# EAGLE design MODULO2_pp (EAGLE 7.1.0)
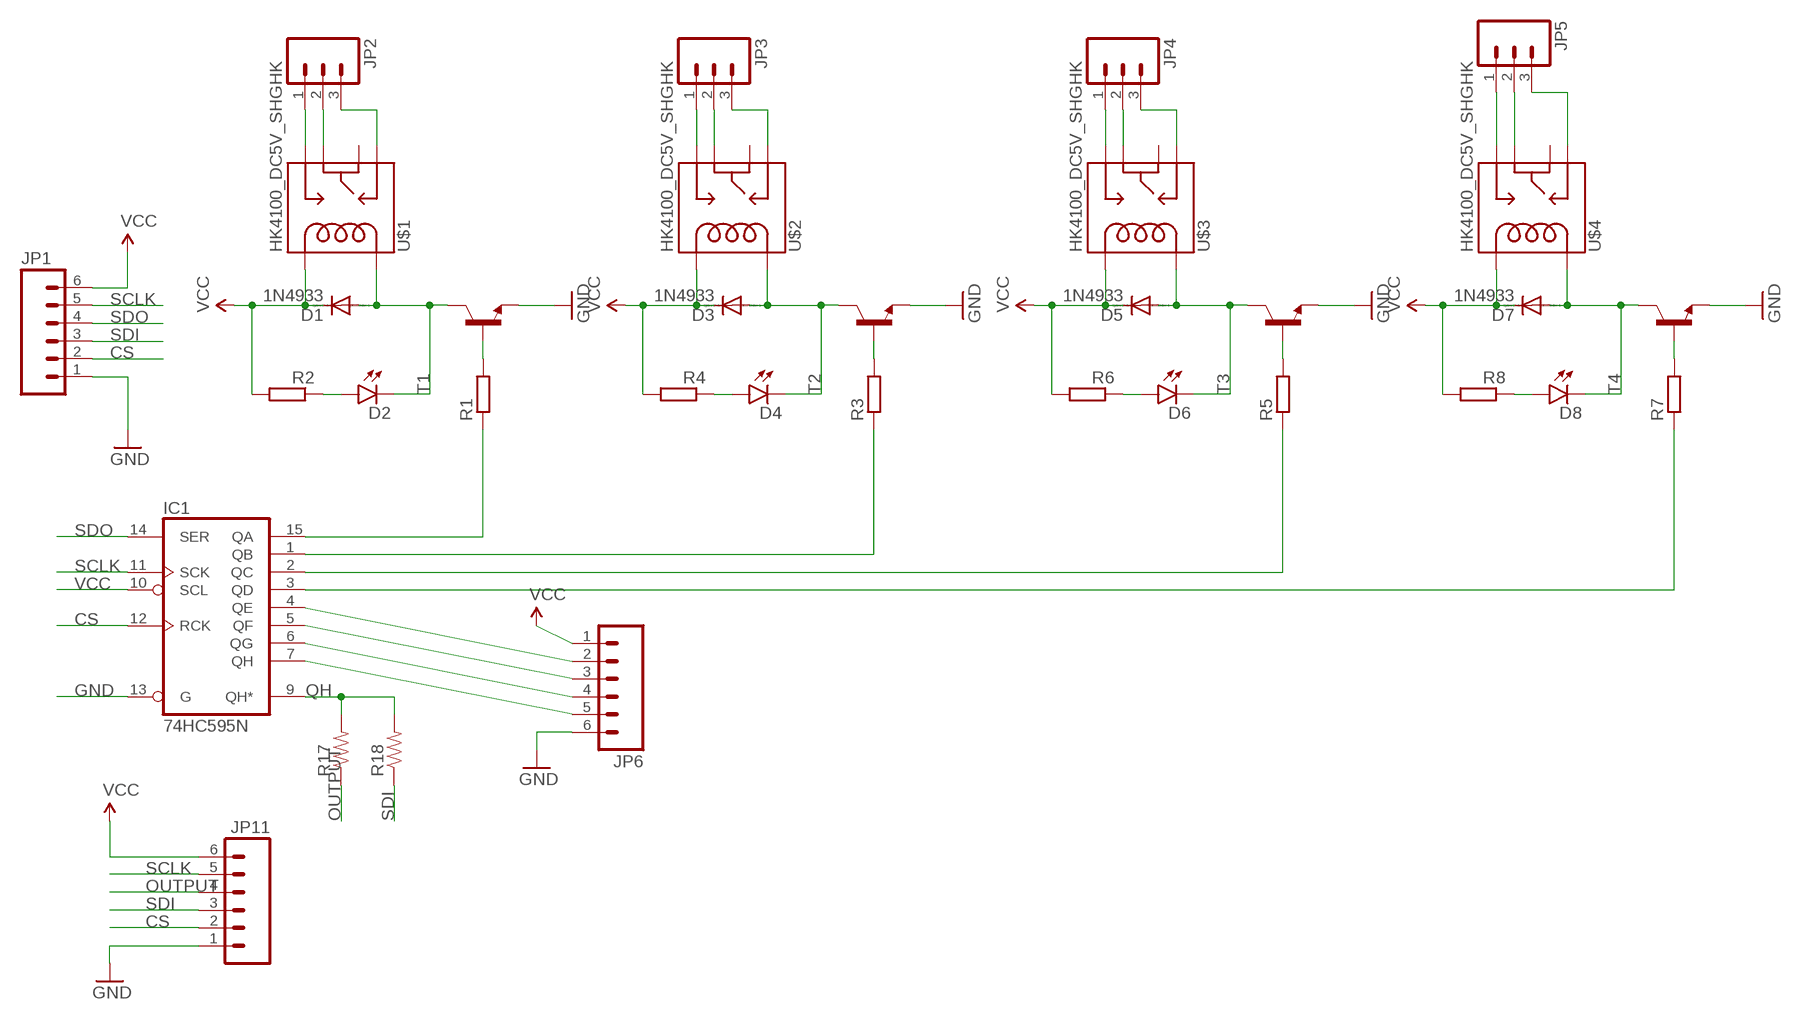
[diagram p0: schematic, sheet 1]

## Parts
D1  1N4933  [DO41-10]
D2  LED5MM  [LED5MM]
D3  1N4933  [DO41-10]
D4  LED5MM  [LED5MM]
D5  1N4933  [DO41-10]
D6  LED5MM  [LED5MM]
D7  1N4933  [DO41-10]
D8  LED5MM  [LED5MM]
IC1  74HC595N  [DIL16]
JP1  M06SILK_FEMALE_PTH  [1X06]
JP2  M03-SCREW-5MM  [SCREWTERMINAL-5MM-3]
JP3  M03-SCREW-5MM  [SCREWTERMINAL-5MM-3]
JP4  M03-SCREW-5MM  [SCREWTERMINAL-5MM-3]
JP5  M03-SCREW-5MM  [SCREWTERMINAL-5MM-3]
JP6  M06SILK_FEMALE_PTH  [1X06]
JP11  M06SILK_FEMALE_PTH  [1X06]
R1  R-EU_R0805  [R0805]
R2  R-EU_R0805  [R0805]
R3  R-EU_R0805  [R0805]
R4  R-EU_R0805  [R0805]
R5  R-EU_R0805  [R0805]
R6  R-EU_R0805  [R0805]
R7  R-EU_R0805  [R0805]
R8  R-EU_R0805  [R0805]
R17  RESISTOR0805-RES  [0805]
R18  RESISTOR0805-RES  [0805]
T1  -NPN-TO92-EBC  [TO92-EBC]
T2  -NPN-TO92-EBC  [TO92-EBC]
T3  -NPN-TO92-EBC  [TO92-EBC]
T4  -NPN-TO92-EBC  [TO92-EBC]
U$1  HK4100_DC5V_SHGHK  [HK4100]
U$2  HK4100_DC5V_SHGHK  [HK4100]
U$3  HK4100_DC5V_SHGHK  [HK4100]
U$4  HK4100_DC5V_SHGHK  [HK4100]

## Nets
CS: IC1.12(RCK) JP1.2 JP11.2
GND: IC1.13(G) JP1.1 JP6.6 JP11.1 T1.E T2.E T3.E T4.E
N$1: IC1.15(QA) R1.1
N$2: IC1.1(QB) R3.1
N$3: D1.A D2.K(C) T1.C U$1.6
N$4: D2.A R2.1
N$5: R1.2 T1.B
N$6: D3.A D4.K(C) T2.C U$2.6
N$7: D5.A D6.K(C) T3.C U$3.6
N$8: D6.A R6.1
N$9: R5.2 T3.B
N$10: D7.A D8.K(C) T4.C U$4.6
N$11: D8.A R8.1
N$12: R7.2 T4.B
N$13: IC1.3(QD) R7.1
N$14: D4.A R4.1
N$15: R3.2 T2.B
N$16: IC1.2(QC) R5.1
N$17: IC1.4(QE) JP6.2
N$18: IC1.5(QF) JP6.3
N$19: IC1.6(QG) JP6.4
N$20: IC1.7(QH) JP6.5
N$33: JP2.1 U$1.8
N$34: JP2.2 U$1.14
N$35: JP2.3 U$1.7
N$36: JP3.1 U$2.8
N$37: JP3.2 U$2.14
N$38: JP3.3 U$2.7
N$39: JP4.1 U$3.8
N$40: JP4.2 U$3.14
N$41: JP4.3 U$3.7
N$42: JP5.1 U$4.8
N$43: JP5.2 U$4.14
N$44: JP5.3 U$4.7
OUTPUT: JP11.4 R17.1
QH: IC1.9(QH*) R17.2 R18.2
SCLK: IC1.11(SCK) JP1.5 JP11.5
SDI: JP1.3 JP11.3 R18.1
SDO: IC1.14(SER) JP1.4
VCC: D1.C D3.C D5.C D7.C IC1.10(SCL) JP1.6 JP6.1 JP11.6 R2.2 R4.2 R6.2 R8.2 U$1.9 U$2.9 U$3.9 U$4.9
Unconnected: U$1.1 U$2.1 U$3.1 U$4.1

## Power pins joined to a net without a drawn wire
GND: IC1.8(GND)
VCC: IC1.16(VCC)

## Library data of the parts
D1 D3 D5 D7 = diode:1N4933: DIODE fast recovery rectifier, 1A
D2 D4 D6 D8 = SparkFun-LED:LED: LEDs Standard schematic elements and footprints for 5mm, 3mm, 1206, and 0603 sized LEDs. 5mm - Spark Fun Electronics SKU : COM-00529 (and others)
IC1 = 74xx-eu:74*595: 8-bit SHIFT REGISTER, output latch
JP1 JP6 JP11 = SparkFun-Connectors:M06: Header 6 Standard 6-pin 0.1" header. Use with straight break away headers (SKU : PRT-00116), right angle break away headers (PRT-00553), swiss pins (PRT-00743), machine pins (PRT-00117), and female headers (PRT-00115). Molex polarized connector foot print use with SKU : PRT-08094 with associated crimp pins and housings. NOTES ON THE VARIANTS LOCK and LOCK_LONGPADS... This footprint was designed to help hold the alignment of a through-hole component (i.e. 6-pin header) while soldering it into place. You may notice that each hole has been shifted either up or down by 0.005 of an inch from it's more standard position (which is a perfectly straight line). This slight alteration caused the pins (the squares in the middle) to touch the edges of the holes. Because they are alternating, it causes a "brace" to hold the component in place. 0.005 has proven to be the perfect amount of "off-center" position when using our standard breakaway headers. Although looks a little odd when you look at the bare footprint, once you have a header in there, the alteration is very hard to notice. Also,if you push a header all the way into place, it is covered up entirely on the bottom side. This idea of altering the position of holes to aid alignment will be further integrated into the Sparkfun Library for other footprints. It can help hold any component with 3 or more connection pins.; PROD_ID: CONN-08437
JP2-JP5 = SparkFun-Connectors:M03: Header 3 Standard 3-pin 0.1" header. Use with straight break away headers (SKU : PRT-00116), right angle break away headers (PRT-00553), swiss pins (PRT-00743), machine pins (PRT-00117), and female headers (PRT-00115). Molex polarized connector foot print use with SKU : PRT-08232 with associated crimp pins and housings.; STOREFRONT_ID: PRT-08433
R1-R8 = resistor:R-EU_: RESISTOR, European symbol
R17 R18 = SparkFun-Resistors:RESISTOR: Resistor Basic schematic elements and footprints for 0603, 1206, and PTH resistors.
T1-T4 = transistor:*-NPN-: NPN Transistror BF959 corrected 2008.03.06
U$1-U$4 = SparkFun-Electromechanical:HK4100_DC5V_SHG

## Board
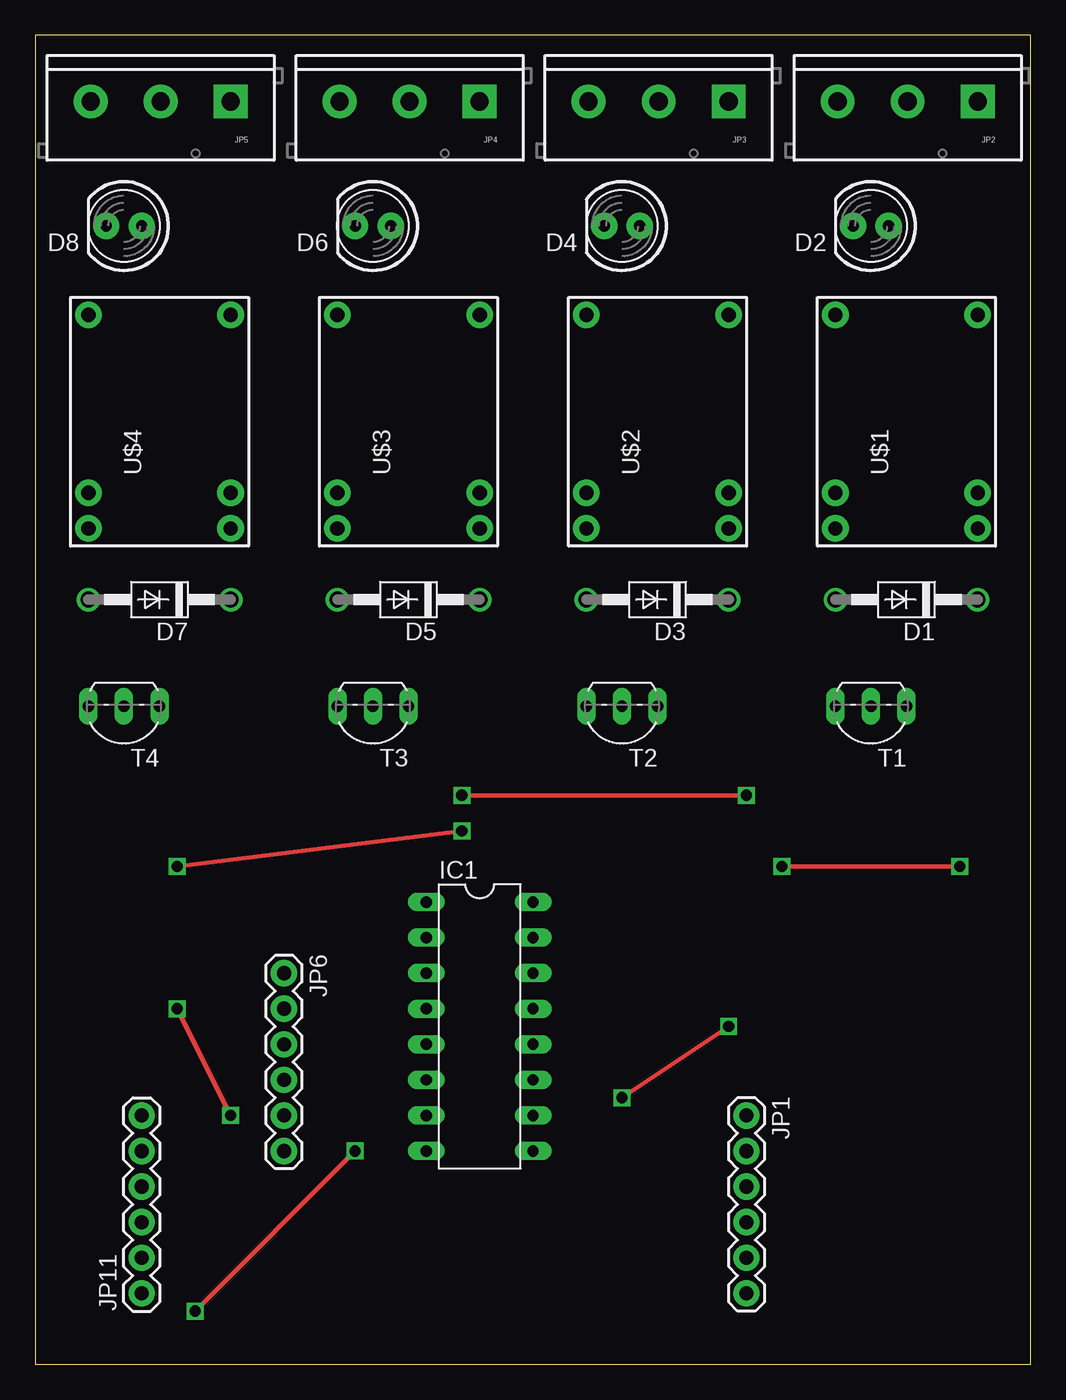
[diagram p1: board, top side]
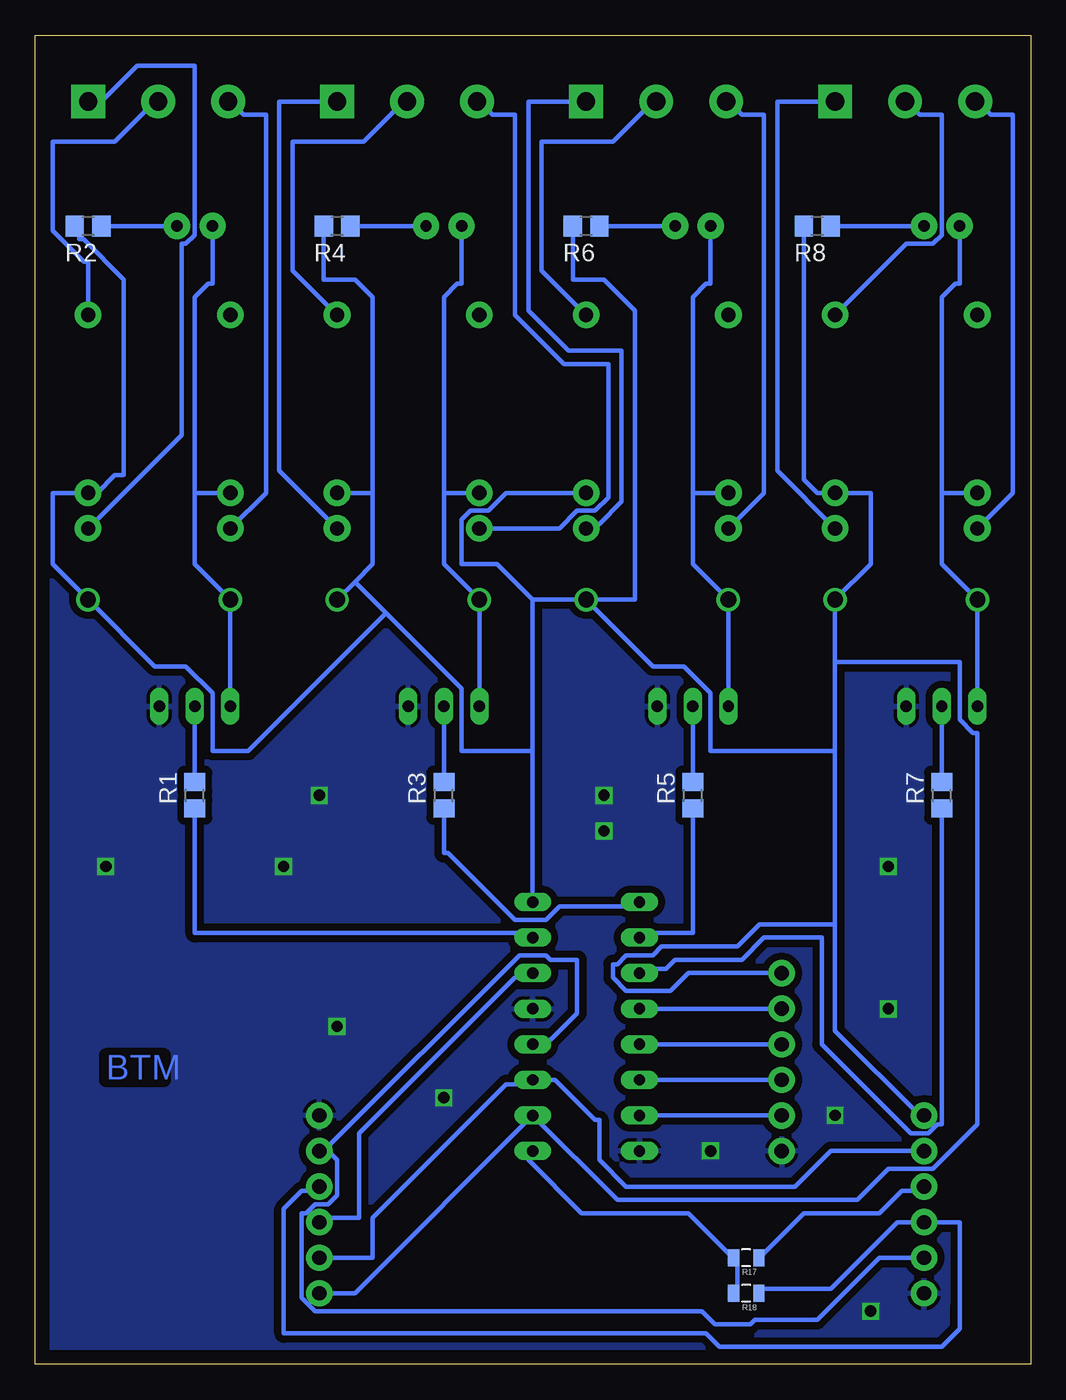
[diagram p2: board, bottom side, seen from below]

Size 71.1 x 94.92 mm. Coordinates in mm from the lower left corner, seen from the top.
Outline: 0,0 71.1,0 71.1,94.92 0,94.92 0,0
Copper layers (1*16): Top 0.035mm / dielectric 1.5mm / Bottom 0.035mm
Design rules "default *": minimum track width 13mil, minimum drill 24mil, track to track 20mil, track to pad 6mil, pad to pad 8mil, via to via 8mil, smd to smd 8mil, copper to edge 40mil, drill to drill 8mil, minimum pad ring 10mil, minimum via ring 8mil, stop-mask expansion 4mil, vias tented up to drill 0mil, thermal gap 10mil

### Footprints (pad centres in the part's own frame; a part is rotated, then mirrored left to right if it is on the bottom)
DO41-10 = drill 1.118: A 5.08,0; C -5.08,0
LED5MM = drill 0.813 pad 1.88: A -1.27,0; K 1.27,0
DIL16 = drill 0.813 long: 1 -8.89,-3.81; 2 -6.35,-3.81; 3 -3.81,-3.81; 4 -1.27,-3.81; 5 1.27,-3.81; 6 3.81,-3.81; 7 6.35,-3.81; 8 8.89,-3.81; 9 8.89,3.81; 10 6.35,3.81; 11 3.81,3.81; 12 1.27,3.81; 13 -1.27,3.81; 14 -3.81,3.81; 15 -6.35,3.81; 16 -8.89,3.81
1X06 = drill 1.016 pad 1.88: 1 0,0; 2 2.54,0; 3 5.08,0; 4 7.62,0; 5 10.16,0; 6 12.7,0
SCREWTERMINAL-5MM-3 = drill 1.3 pad 2.413 square: 1 0,0 | drill 1.3 pad 2.413: 2 5,0; 3 10,0
R0805 = smd 1.3 x 1.5: 1 -0.95,0; 2 0.95,0
0805 = smd 0.8 x 1.2: 1 -0.9,0; 2 0.9,0
TO92-EBC = drill 0.813 long: B 0,-1.27; C 2.54,-1.27; E -2.54,-1.27
HK4100 = drill 1.016 pad 1.905: 1 7.62,5.08; 6 -5.08,5.08; 7 -7.62,5.08; 8 -7.62,-5.08; 9 -5.08,-5.08; 14 7.62,-5.08

### Placement (x,y rotation side)
D1  62.23,54.61 180 top
D2  59.69,81.28 180 top
D3  44.45,54.61 180 top
D4  41.91,81.28 180 top
D5  26.67,54.61 180 top
D6  24.13,81.28 180 top
D7  8.89,54.61 180 top
D8  6.35,81.28 180 top
IC1  31.75,24.13 270 top
JP1  50.8,17.78 270 top
JP2  67.31,90.17 180 top
JP3  49.53,90.17 180 top
JP4  31.75,90.17 180 top
JP5  13.97,90.17 180 top
JP6  17.78,27.94 270 top
JP11  7.62,5.08 90 top
R1  59.69,40.64 90 bottom
R2  67.31,81.28 180 bottom
R3  41.91,40.64 90 bottom
R4  49.53,81.28 180 bottom
R5  24.13,40.64 90 bottom
R6  31.75,81.28 180 bottom
R7  6.35,40.64 90 bottom
R8  15.24,81.28 180 bottom
R17  20.32,7.62 180 bottom
R18  20.32,5.08 180 bottom
T1  59.69,45.72 180 top
T2  41.91,45.72 180 top
T3  24.13,45.72 180 top
T4  6.35,45.72 180 top
U$1  62.23,67.31 90 top
U$2  44.45,67.31 90 top
U$3  26.67,67.31 90 top
U$4  8.89,67.31 90 top

### Tracks (layer width: path | path; a pad name or v marks a point on that pad's centre or on a via)
CS
  Bottom 0.33: IC1.12 35.24,23.18 34.29,23.18 32.38,25.08 32.38,28.89 34.29,28.89 34.61,29.21 36.51,29.21 50.48,15.24 | JP11.2 10.79,7.62 15.24,3.17 19.68,3.17 20,2.86 22.54,2.86 23.5,3.81 51.12,3.81 52.07,4.76 52.07,10.79 51.75,10.79 51.12,11.43 50.16,11.43 49.53,12.06 49.53,14.61 50.16,15.24 50.48,15.24 | 50.48,15.24 JP1.2
GND  (via drill 0.8)
  Top 0.305: v50.8,40.64 v30.48,40.64 | v41.91,19.05 v49.53,24.13 | v11.43,3.81 v22.86,15.24 | v10.16,35.56 v30.48,38.1 | v53.34,35.56 v66.04,35.56 | v10.16,25.4 v13.97,17.78
  pour Bottom (isolate 0.508): 0,95.25 71.12,95.25 71.12,0 0,0
N$1
  Bottom 0.33: R1.1 59.69,30.8 35.88,30.8 IC1.15
N$2
  Bottom 0.33: R3.1 41.91,36.51 41.59,36.51 36.83,31.75 34.61,31.75 33.66,32.7 28.26,32.7 IC1.1
N$3
  Bottom 0.33: T1.C D1.A 59.69,57.15 59.69,62.23 | D2.K 58.42,77.15 58.74,77.15 59.69,76.2 59.69,62.23 | U$1.6 59.69,62.23
N$4
  Bottom 0.33: D2.A R2.1
N$5
  Bottom 0.33: T1.B R1.2
N$6
  Bottom 0.33: T2.C D3.A 41.91,57.15 41.91,62.23 | D4.K 40.64,77.15 40.96,77.15 41.91,76.2 41.91,62.23 | U$2.6 41.91,62.23
N$7
  Bottom 0.33: T3.C D5.A 24.13,57.15 24.13,62.23 | D6.K 22.86,77.15 23.18,77.15 24.13,76.2 24.13,62.23 | U$3.6 24.13,62.23
N$8
  Bottom 0.33: D6.A R6.1
N$9
  Bottom 0.33: T3.B R5.2
N$10
  Bottom 0.33: T4.C D7.A 6.35,57.15 6.35,62.23 | D8.K 5.08,77.15 5.4,77.15 6.35,76.2 6.35,62.23 | U$4.6 6.35,62.23
N$11
  Bottom 0.33: D8.A R8.1
N$12
  Bottom 0.33: T4.B R7.2
N$13
  Bottom 0.33: R7.1 6.35,17.14 6.67,17.14 7.3,16.51 8.57,16.51 14.92,22.86 14.92,30.48 19.05,30.48 20.64,28.89 25.4,28.89 26.04,28.26 27.62,28.26 IC1.3
N$14
  Bottom 0.33: D4.A R4.1
N$15
  Bottom 0.33: T2.B R3.2
N$16
  Bottom 0.33: R5.1 24.13,30.8 27.62,30.8 IC1.2
N$17
  Bottom 0.33: JP6.2 IC1.4
N$18
  Bottom 0.33: JP6.3 IC1.5
N$19
  Bottom 0.33: JP6.4 IC1.6
N$20
  Bottom 0.33: JP6.5 IC1.7
N$33
  Bottom 0.33: U$1.8 60.64,66.36 60.64,80.01 60.33,80.01 59.69,80.64 59.69,92.71 63.82,92.71 66.36,90.17 JP2.1
N$34
  Bottom 0.33: U$1.14 67.31,78.74 67.63,78.74 69.85,80.96 69.85,87.31 65.41,87.31 62.55,90.17 JP2.2
N$35
  Bottom 0.33: U$1.7 54.61,62.23 54.61,89.22 56.2,89.22 57.15,90.17 JP2.3
N$36
  Bottom 0.33: U$2.8 53.66,63.82 53.66,90.17 JP3.1
N$37
  Bottom 0.33: U$2.14 52.7,78.11 52.7,87.31 47.62,87.31 44.77,90.17 JP3.2
N$38
  Bottom 0.33: U$2.7 33.66,59.69 32.38,60.96 31.11,60.96 30.16,61.91 30.16,71.44 33.34,71.44 36.83,74.93 36.83,89.22 38.42,89.22 39.37,90.17 JP3.3
N$39
  Bottom 0.33: U$3.8 31.43,60.01 30.8,60.01 29.21,61.59 29.21,72.39 33.02,72.39 35.88,75.25 35.88,90.17 JP4.1
N$40
  Bottom 0.33: U$3.14 34.92,78.11 34.92,87.31 29.84,87.31 26.99,90.17 JP4.2
N$41
  Bottom 0.33: U$3.7 19.05,62.23 19.05,89.22 20.64,89.22 21.59,90.17 JP4.3
N$42
  Bottom 0.33: U$4.8 18.1,63.82 18.1,90.17 JP5.1
N$43
  Bottom 0.33: U$4.14 8.89,80.01 6.99,80.01 6.35,80.64 6.35,89.22 7.94,89.22 8.89,90.17 JP5.2
N$44
  Bottom 0.33: U$4.7 1.27,62.23 1.27,89.22 2.86,89.22 3.81,90.17 JP5.3
OUTPUT
  Bottom 0.33: R17.1 19.37,7.62 16.19,10.79 10.79,10.79 9.21,12.38 8.26,12.38 7.94,12.7 JP11.4
QH
  Bottom 0.33: R18.2 20.95,5.08 20.95,7.62 R17.2 21.27,7.62 24.45,10.79 32.07,10.79 35.88,14.61 35.88,15.24 IC1.9
SCLK
  Bottom 0.33: JP1.5 46.99,7.62 46.99,10.48 37.47,20 35.88,20 IC1.11 33.97,20.32 31.11,17.46 30.8,17.46 30.8,14.61 28.89,12.7 16.83,12.7 14.29,15.24 JP11.5
SDI
  Bottom 0.33: R18.1 19.37,5.08 19.05,5.4 14.29,5.4 9.53,10.16 JP11.3 5.08,10.16 5.08,4.13 5.08,2.54 6.35,1.27 22.23,1.27 22.86,1.91 23.18,2.22 53.34,2.22 53.34,11.11 52.07,12.38 51.12,12.38 JP1.3
SDO
  Bottom 0.33: IC1.14 35.88,27.62 36.83,27.62 47.94,16.51 47.94,10.48 50.16,10.48 50.48,10.16 JP1.4
VCC
  Bottom 0.33: R2.2 67.94,81.28 67.94,80.33 67.63,80.33 64.77,77.47 64.77,63.5 65.41,63.5 66.67,62.23 U$1.9 69.85,62.23 69.85,57.15 D1.C 62.55,49.85 60.33,49.85 58.42,47.94 58.42,43.81 55.88,43.81 46.04,53.66 | 46.99,62.23 46.99,76.2 48.26,77.47 50.48,77.47 R4.2 | U$2.9 46.99,62.23 | 48.26,55.88 46.99,57.15 46.99,62.23 | 48.26,55.88 D3.C | D5.C 28.26,54.61 28.26,75.25 30.48,77.47 32.7,77.47 R6.2 | 35.56,54.61 35.56,43.81 | 35.56,43.81 IC1.16 | D5.C 35.56,54.61 | U$3.9 37.47,62.23 38.73,60.96 40.01,60.96 40.64,60.33 40.64,57.15 38.1,57.15 35.56,54.61 | 46.04,53.66 40.64,48.26 40.64,43.81 35.56,43.81 | 46.04,53.66 48.26,55.88 | JP1.6 48.26,5.08 IC1.10 29.53,11.75 12.38,11.75 10.16,13.97 6.99,13.97 3.81,17.14 3.81,45.09 4.13,45.09 5.08,46.04 5.08,50.16 13.97,50.16 | R8.2 16.19,63.18 15.24,62.23 U$4.9 11.43,62.23 11.43,57.15 D7.C 13.97,50.16 | 13.97,50.16 13.97,43.81 | 13.97,43.81 13.97,31.43 | 13.97,31.43 13.97,23.81 7.94,17.78 JP11.6 | JP6.1 24.45,27.94 25.72,26.67 28.89,26.67 29.84,27.62 29.84,28.57 29.53,28.57 28.89,29.21 26.99,29.21 26.35,29.84 20.95,29.84 19.37,31.43 13.97,31.43 | D5.C 26.99,49.85 24.77,49.85 22.86,47.94 22.86,43.81 13.97,43.81

### Text on the board
Bottom: BTM